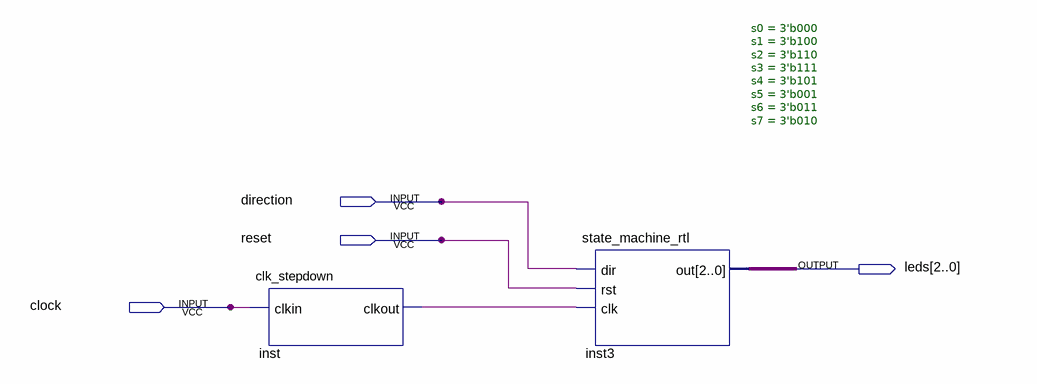
[diagram p0: schematic sheet]
// Quartus schematic state_machine.bdf as structural Verilog: 2 symbols, 4 pins
module state_machine (
  input  direction,
  input  reset,
  input  clock,
  output [2:0] leds
);

  wire inst_clkout;

  clk_stepdown inst (.clkin(clock), .clkout(inst_clkout));
  state_machine_rtl #(.s0(3'b000), .s1(3'b100), .s2(3'b110), .s3(3'b111), .s4(3'b101), .s5(3'b001), .s6(3'b011), .s7(3'b010)) inst3 (
    .dir(direction), .rst(reset), .clk(inst_clkout), .out(leds));
endmodule
